# Altium schematic sheet Sensors.SchDoc
size A
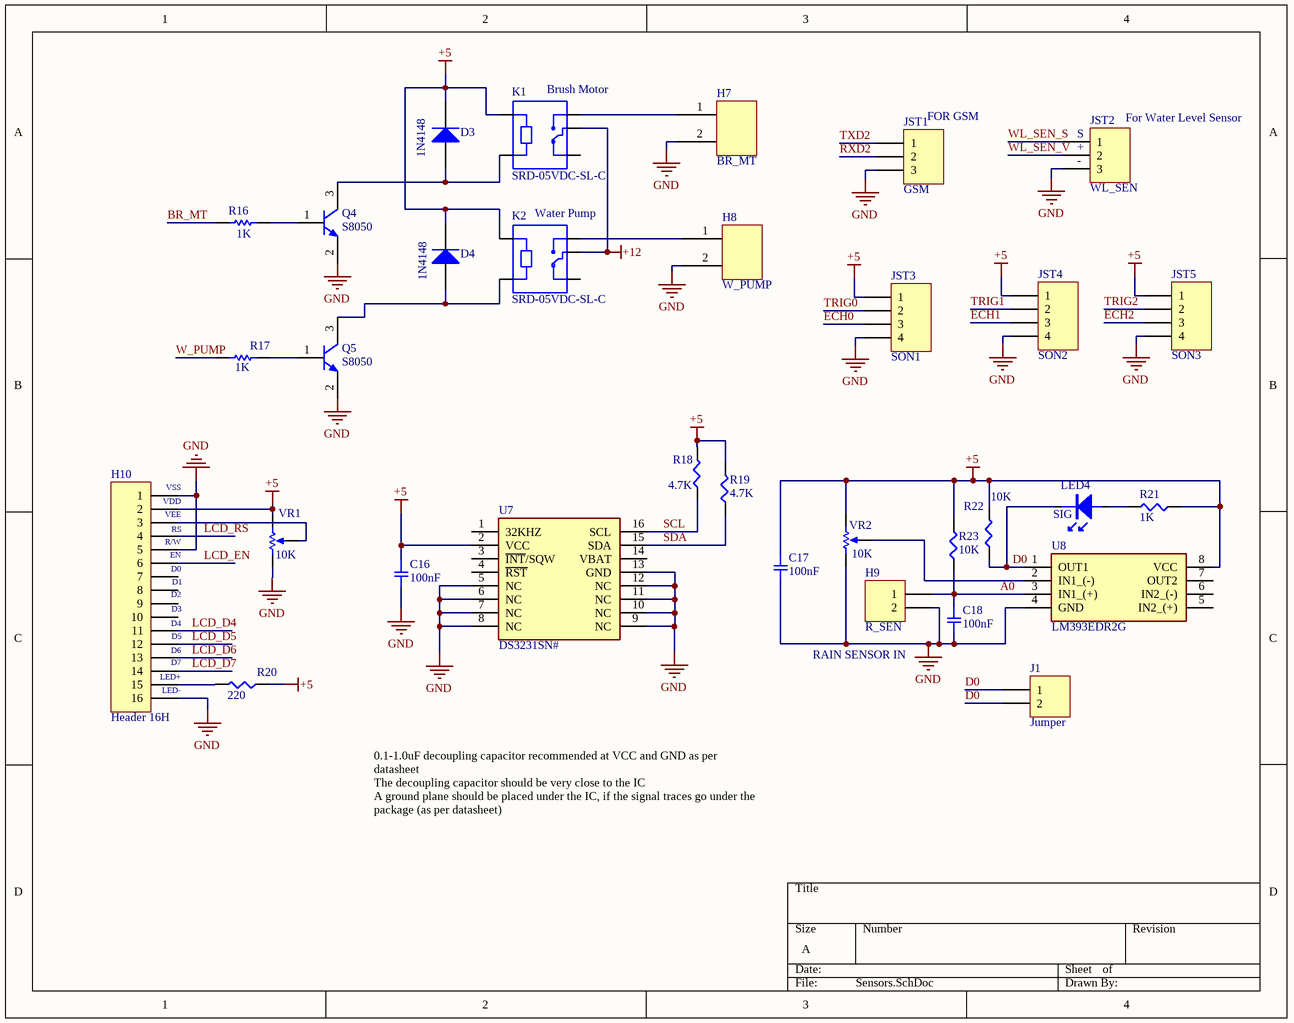
[diagram p0: Sensors.SchDoc]

## Parts
C16  100nF  [SMD-0805C]
C17  100nF  [SMD-0805C]
C18  100nF  [SMD-0805C]
D3  1N4148  [LL4148-L3.7 SMD(LCSC)]
D4  1N4148  [LL4148-L3.7 SMD(LCSC)]
H7  BR_MT  [Header_I2]
H8  W_PUMP  [Header_I2]
H9  R_SEN  [HDR1X2]
H10  Header 16H  [HDR1X16H]
J1  Jumper  [HDR1X2]
JST1  GSM  [HDR1X3]
JST2  WL_SEN  [HDR1X3]
JST3  SON1  [HDR1X4]
JST4  SON2  [HDR1X4]
JST5  SON3  [HDR1X4]
K1  SRD-05VDC-SL-C  [SRD-05VDC-SL-C]
K2  SRD-05VDC-SL-C  [SRD-05VDC-SL-C]
LED4  SIG  [RED_LED_0805]
Q4  S8050  [SMT_TRIODE_NPN]
Q5  S8050  [SMT_TRIODE_NPN]
R16  1K  [SMD-0805-RES]
R17  1K  [SMD-0805-RES]
R18  4.7K  [SMD-0805-RES]
R19  4.7K  [SMD-0805-RES]
R20  220  [SMD-0805-RES]
R21  1K  [SMD-0805-RES]
R22  10K  [SMD-0805-RES]
R23  10K  [SMD-0805-RES]
U7  DS3231SN#  [DS3231(Module-footprint)]
U8  LM393EDR2G  [SOIC-8]
VR1  value 10K  [VR7(LCSC)]  (hidden comment: 10K potentiometer)
VR2  value 10K  [VR7(LCSC)]  (hidden comment: 10K potentiometer)

## Nets
+5: C16.1 C17.1 D3.2(K) D4.2(K) H10.2 JST3.1 JST4.1 JST5.1 K1.A1 K2.A1 R18.2 R19.2 R20.1 R21.1 R22.2 R23.2 U7.2(VCC) U8.8(VCC) VR1.3(TOP) VR2.3(TOP)
+12: K1.COM K2.COM
GND: C16.2 C17.2 C18.2 H7.2 H8.2 H9.2 H10.1 H10.5 H10.16 JST1.3 JST2.3 JST3.4 JST4.4 JST5.4 Q4.2(E) Q5.2(E) U7.5(NC) U7.6(NC) U7.7(NC) U7.8(NC) U7.9(NC) U7.10(NC) U7.11(NC) U7.12(NC) U7.13(GND) U8.4(GND) VR1.1(BOT) VR2.1(BOT)
A0: C18.1 H9.1 R23.1 U8.3(IN1_(+))
BR_MT: R16.1
D0: J1.1 J1.2 LED4.2(K) R22.1 U8.1(OUT1)
ECH0: JST3.3
ECH1: JST4.3
ECH2: JST5.3
LCD_D4: H10.11
LCD_D5: H10.12
LCD_D6: H10.13
LCD_D7: H10.14
LCD_EN: H10.6
LCD_RS: H10.4
RXD2: JST1.2
SCL: R18.1 U7.16(SCL)
SDA: R19.1 U7.15(SDA)
TRIG0: JST3.2
TRIG1: JST4.2
TRIG2: JST5.2
TXD2: JST1.1
W_PUMP: R17.1
WL_SEN_S: JST2.1
WL_SEN_V: JST2.2
NetD3_1: D3.1(A) K1.A2 Q4.3(C)
NetD4_1: D4.1(A) K2.A2 Q5.3(C)
NetH7_1: H7.1 K1.NO
NetH8_1: H8.1 K2.NO
NetH10_3: H10.3 VR1.2(TAP)
NetH10_15: H10.15 R20.2
NetLED4_1: LED4.1(A) R21.2
NetQ4_1: Q4.1(B) R16.2
NetQ5_1: Q5.1(B) R17.2
NetU8_2: U8.2(IN1_(-)) VR2.2(TAP)

Not connected (* = marked no-connect by the designer): H10 7 8 9 10; K1 NC; K2 NC; U7 1(32KHZ) 3(~{INT}/SQW) 4(~{RST}) 14(VBAT); U8 5(IN2_(+)) 6(IN2_(-)) 7(OUT2)

## Notes on the sheet
- (near K1) Brush Motor
- (near JST1) FOR GSM
- (near JST2) S
- (near JST2) +
- (near JST2) -
- (near JST2) For Water Level Sensor
- (near K2) Water Pump
- (near H10) VDD
- (near H10) VSS
- (near H10) VEE
- (near H10) R/W
- (near H10) EN
- (near H10) D0
- (near H10) RS
- (near H10) D4
- (near H10) D2
- (near H10) D5
- (near H10) D3
- (near H10) D1
- (near H10) LED+
- (near H10) LED-
- (near H10) D6
- (near H10) D7
- RAIN SENSOR IN
- 0.1-1.0uF decoupling capacitor recommended at VCC and GND as per datasheet                                                                                                           The decoupling capacitor should be very close to the IC                                              A ground plane should be placed under the IC, if the signal traces go under the package (as per datasheet)

## Library data of the parts
C16-C18 = GC321AD72E103KX01D: CAP CER 10000PF 250V X7T 0805; Manufacturer: Murata Electronics North America; Factory Stock: 0; Unit Price (USD): 0.3; Minimum Quantity: 1; Tolerance: ±10%; Datasheets: http://search.murata.co.jp/Ceramy/image/img/A01X/G101/ENG/GC321AD72E103KX01-01.pdf; Image: //media.digikey.com/Renders/Murata%20Renders/0805(GC3)200x125.jpg; Digi-Key Part Number: 490-13986-1-ND; Part Number: GC321AD72E103KX01D; Quantity Available: 4000; @ qty: 0; Packaging: Cut Tape (CT); Series: GC3; Part Status: Active; Value: 10000pF; Voltage: 250V; Temperature Coefficient: X7T; Operating Temperature: -55°C ~ 125°C; Features: -; Ratings: AEC-Q200; Applications: Automotive; Mounting Type: Surface Mount, MLCC; Package / Case: 0805 (2012 Metric); Size / Dimension: 0.079" L x 0.049" W (2.00mm x 1.25mm); Height - Seated (Max): -; Thickness (Max): 0.039" (1.00mm); Lead Spacing: -; Lead Style: -
D3 D4 = Diode 1N4148: High Conductance Fast Diode; Published: 8-Jun-2000; LatestRevisionDate: 17-Jul-2002; LatestRevisionNote: Re-released for DXP Platform.; DatasheetVersion: 1997; PackageReference: DO-35; Publisher: Altium Limited; PackageDescription: Diode, Axial; Body 3.8 x 1.9 mm (LxDia. max), Lead Dia. 0.53 mm (max); Code_JEDEC: DO-204-AH; ComponentLink1Description: Manufacturer Link; ComponentLink1URL: http://www.fairchildsemi.com/; ComponentLink2Description: Datasheet; ComponentLink2URL: http://www.fairchildsemi.com/ds/1N%2F1N4148.pdf
H7 H8 = Header_I2: 2-pin single line header (in Blue/green color) Normal; DateCreated: 03/08/2020
H9 J1 = Header 2: Header, 2-Pin; LatestRevisionDate: 17-Jul-2002; LatestRevisionNote: Re-released for DXP Platform.; Publisher: Altium Limited
H10 = Header 16H: Header, 16-Pin, Right Angle; LatestRevisionDate: 17-Jul-2002; LatestRevisionNote: Re-released for DXP Platform.; Publisher: Altium Limited
JST1 JST2 = Header 3: Header, 3-Pin; LatestRevisionDate: 17-Jul-2002; LatestRevisionNote: Re-released for DXP Platform.; Publisher: Altium Limited
JST3-JST5 = Header 4: Header, 4-Pin; LatestRevisionDate: 17-Jul-2002; LatestRevisionNote: Re-released for DXP Platform.; Publisher: Altium Limited
K1 K2 = SRD-05VDC-SL-C: 5V Trigger Relay Module For Arduino And Raspberry Pi 5V Trigger Relay Module For Arduino And Raspberry Pi; MF: Songle Relay; Package: None; Availability: Unavailable; Value: *; MP: SRD-05VDC-SL-C; SnapEDA_Link: https://www.snapeda.com/parts/SRD-05VDC-SL-C/Songle%20Relay/view-part/1029484/?ref=snap; Price: None
LED4 = LED 5V: SMT LED
Q4 Q5 = S8050: S8050 NPN Bipolar Junction Transistor; Published: 8-Jun-2000; LatestRevisionDate: 17-Jul-2002; LatestRevisionNote: Re-released for DXP Platform.; PackageReference: TO-226-AA; Publisher: Altium Limited; PackageDescription: TO, Flat Index; 3 In-Line, Axial Leads; Body Dia. 4.8mm; Leads 0.55 x 0.51 mm (max); Code_JEDEC: TO-226-AA
R16 R17 = Res1: Resistor; Published: 8-Jun-2000; LatestRevisionDate: 17-Jul-2002; LatestRevisionNote: Re-released for DXP Platform.; PackageReference: AXIAL-0.3; Publisher: Altium Limited; PackageDescription: Axial Device, Thru-Hole; 2 Leads; 0.3 in Pin Spacing; Value: 1K
R18-R23 = ERJ-6BQF1R0V: RES SMD 1 OHM 1% 1/3W 0805; Manufacturer: Panasonic Electronic Components; Factory Stock: 0; Unit Price (USD): 0.05834; @ qty: 1500; Minimum Quantity: 1; Value: 1; Power (Watts): 0.333W, 1/3W; Temperature Coefficient: ±200ppm/°C; Part Number: ERJ-6BQF1R0V; Datasheets: https://industrial.panasonic.com/cdbs/www-data/pdf/RDA0000/AOA0000C239.pdf; Image: //media.digikey.com/Renders/Panasonic%20Renders/ERJ-0805%20Pkg.jpg; Digi-Key Part Number: P17499CT-ND; Quantity Available: 808; Packaging: Cut Tape (CT); Series: ERJ; Part Status: Active; Tolerance: ±1%; Composition: Thick Film; Features: Automotive AEC-Q200, Current Sense; Operating Temperature: -55°C ~ 125°C; Package / Case: 0805 (2012 Metric); Supplier Device Package: 0805; Size / Dimension: 0.079" L x 0.049" W (2.00mm x 1.25mm); Height - Seated (Max): 0.028" (0.70mm); Number of Terminations: 2; Failure Rate: -
U7 = DS3231SN#: Real Time Clock IC; Manufacturer_Name: Maxim Integrated; Datasheet Link: https://datasheets.maximintegrated.com/en/ds/DS3231.pdf; Height: 2.65mm; Manufacturer_Part_Number: DS3231SN#; Mouser Part Number: 700-DS3231SN#; Mouser Price/Stock: https://www.mouser.com/Search/Refine.aspx?Keyword=700-DS3231SN%23; RS Part Number: 1897251; RS Price/Stock: http://uk.rs-online.com/web/p/products/1897251
U8 = LM358N: Integrated Circuit; Manufacturer_Name: ON Semiconductor; Datasheet Link: http://www.onsemi.com/pub/Collateral/LM358A-D.pdf; Height: 5.33mm; Manufacturer_Part_Number: LM358N; Arrow Part Number: LM358N; Arrow Price/Stock: https://www.arrow.com/en/products/lm358n/on-semiconductor; Mouser Part Number: 512-LM358N; Mouser Price/Stock: https://www.mouser.co.uk/ProductDetail/ON-Semiconductor-Fairchild/LM358N?qs=K0aVCp%2F7QwafyMXZgr%2FPfw%3D%3D
VR1 VR2 = RPot: Potentiometer; Sim Note: Enter the Resistance value and the set point into parameter fields.; Set Position: 0.5; Published: 8-Jun-2000; LatestRevisionDate: 17-Jul-2002; LatestRevisionNote: Re-released for DXP Platform.; PackageReference: VR5; Publisher: Altium Limited; PackageDescription: Variable Resistor, Thru-Hole; 3 Leads